# EAGLE design kanal_v1 (EAGLE 6.3)
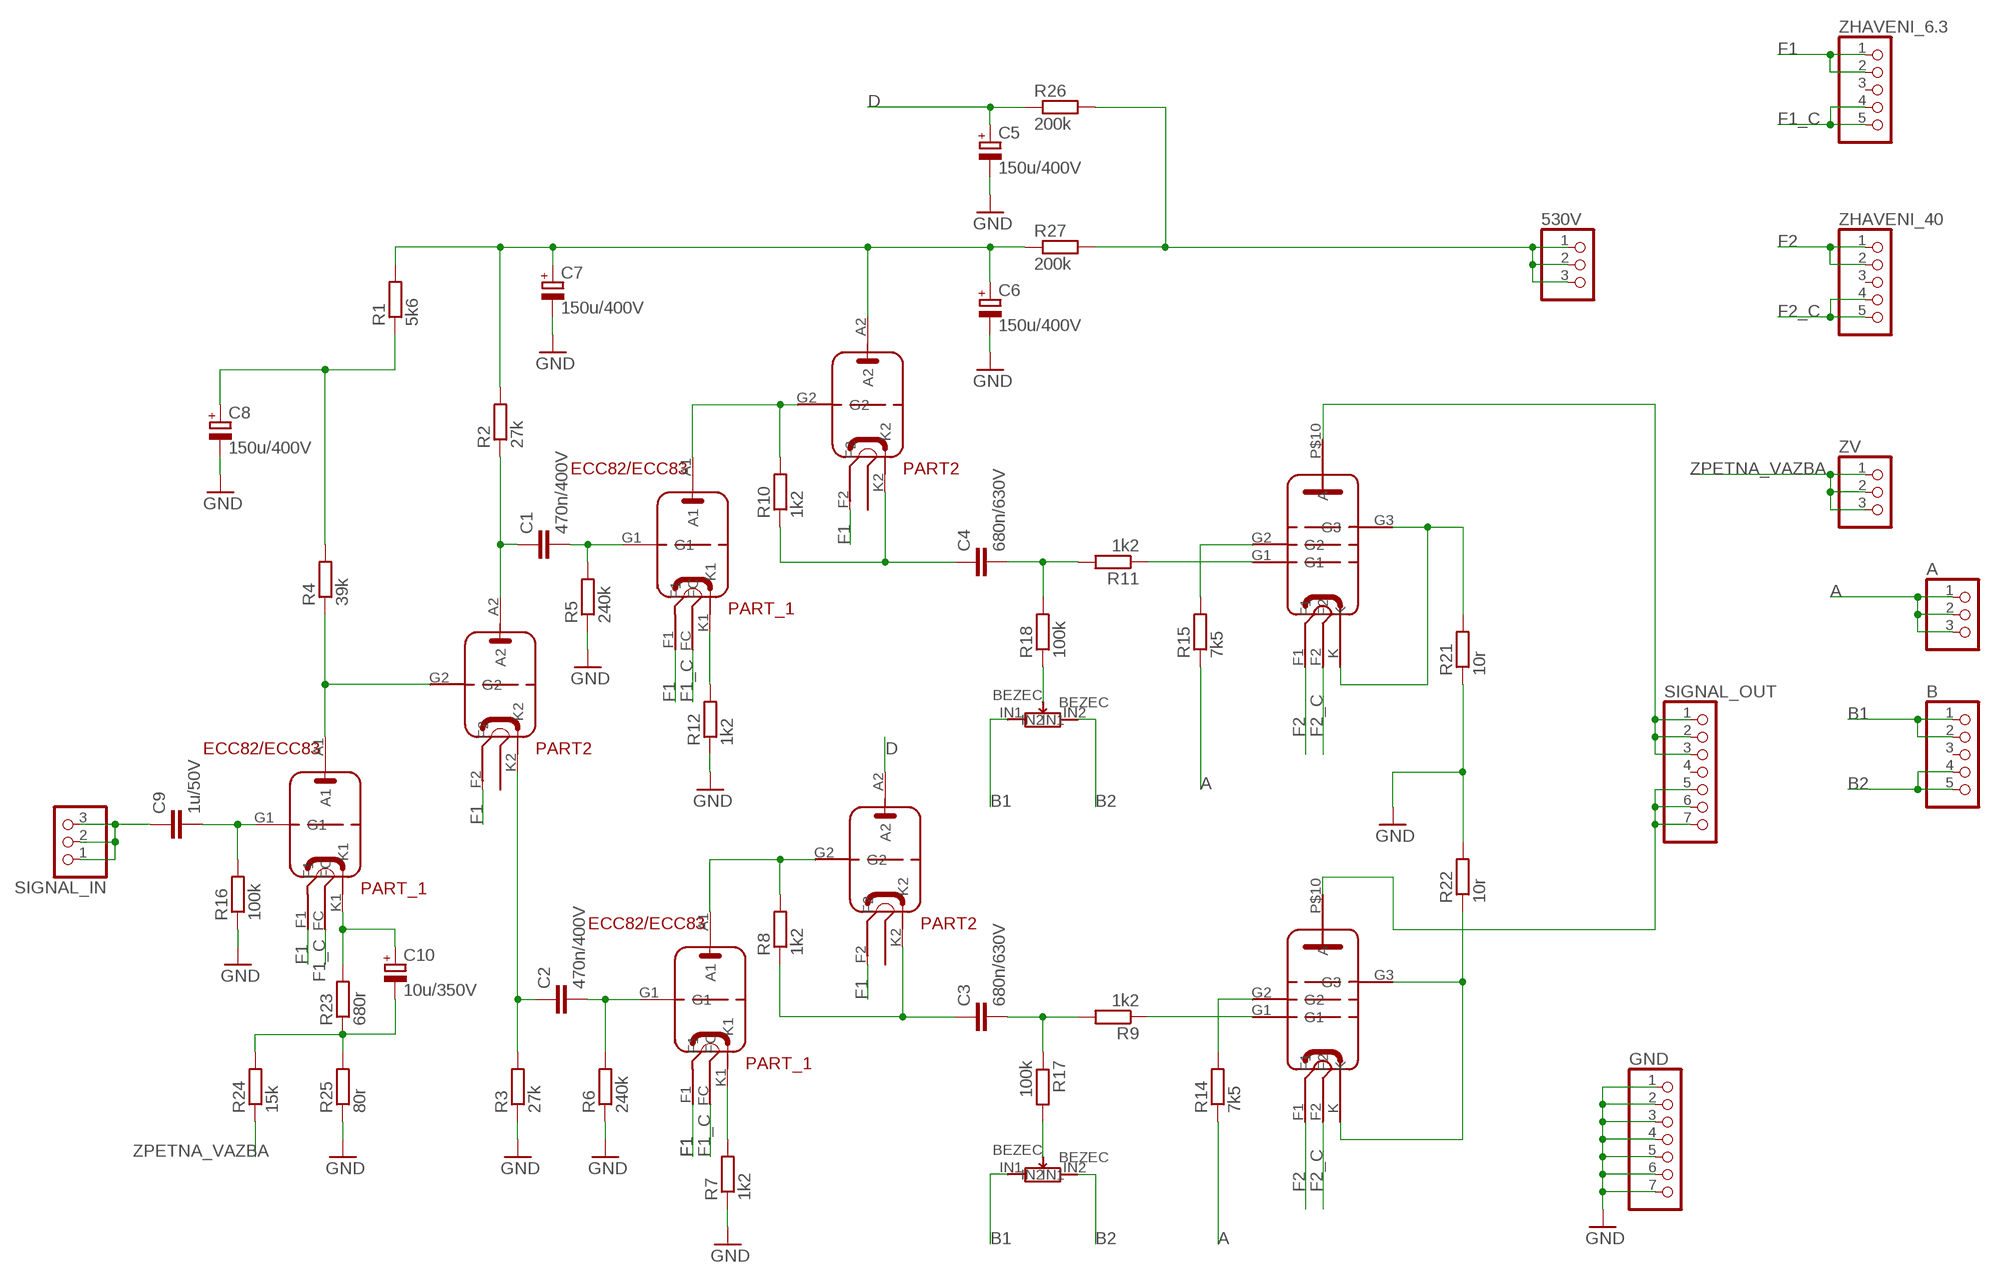
[diagram p0: schematic, sheet 1]

## Parts
530V  PINHD-1X3  [1X03]
A  PINHD-1X3  [1X03]
B  PINHD-1X5  [1X05]
C1  470n/400V  C15/7  [C15B7]
C2  470n/400V  C15/7  [C15B7]
C3  680n/630V  C27/11  [C27.5B11]
C4  680n/630V  C27/11  [C27.5B11]
C5  150u/400V  CPOL-EUE10-25  [EB25D]
C6  150u/400V  CPOL-EUE10-25  [EB25D]
C7  150u/400V  CPOL-EUE10-25  [EB25D]
C8  150u/400V  CPOL-EUE10-25  [EB25D]
C9  1u/50V  C5/3.5  [C5B3.5]
C10  10u/350V  CPOL-EUE5-10.5  [E5-10,5]
GND  PINHD-1X7  [1X07]
R1  5k6  R-EU_0309/10  [0309/10]
R2  27k  R-EU_0309/10  [0309/10]
R3  27k  R-EU_0309/10  [0309/10]
R4  39k  R-EU_0309/10  [0309/10]
R5  240k  R-EU_0309/10  [0309/10]
R6  240k  R-EU_0309/10  [0309/10]
R7  1k2  R-EU_0309/10  [0309/10]
R8  1k2  R-EU_0309/10  [0309/10]
R9  1k2  R-EU_0309/10  [0309/10]
R10  1k2  R-EU_0309/10  [0309/10]
R11  1k2  R-EU_0309/10  [0309/10]
R12  1k2  R-EU_0309/10  [0309/10]
R14  7k5  R-EU_0309/10  [0309/10]
R15  7k5  R-EU_0309/10  [0309/10]
R16  100k  R-EU_0309/10  [0309/10]
R17  100k  R-EU_0309/10  [0309/10]
R18  100k  R-EU_0309/10  [0309/10]
R21  10r  R-EU_0309/10  [0309/10]
R22  10r  R-EU_0309/10  [0309/10]
R23  680r  R-EU_0309/10  [0309/10]
R24  15k  R-EU_0309/10  [0309/10]
R25  80r  R-EU_0309/10  [0309/10]
R26  200k  R-EU_0309/10  [0309/10]
R27  200k  R-EU_0309/10  [0309/10]
SIGNAL_IN  PINHD-1X3  [1X03]
SIGNAL_OUT  PINHD-1X7  [1X07]
U$1  ECC82  [ECC82_PACKAGE]
U$2  ECC83  [ECC82_PACKAGE]
U$3  ECC83  [ECC82_PACKAGE]
U$4  PL509  [PL509_PACKAGE]
U$5  PL509  [PL509_PACKAGE]
U$6  TRIMMER  [TRIMMER_15X15_PACKAGE]
U$7  TRIMMER  [TRIMMER_15X15_PACKAGE]
ZHAVENI_6.3  PINHD-1X5  [1X05]
ZHAVENI_40  PINHD-1X5  [1X05]
ZV  PINHD-1X3  [1X03]

## Nets
A: A.1 A.2 A.3 R14.1 R15.1
B1: B.1 B.2 U$6.IN1 U$7.IN1
B2: B.4 B.5 U$6.IN2 U$7.IN2
D: C5.+ R26.1 U$3.A2
F1: U$1.F1 U$1.F2 U$2.F1 U$2.F2 U$3.F1 U$3.F2 ZHAVENI_6.3.1 ZHAVENI_6.3.2
F1_C: U$1.FC U$2.FC U$3.FC ZHAVENI_6.3.4 ZHAVENI_6.3.5
F2: U$4.F1 U$5.F1 ZHAVENI_40.1 ZHAVENI_40.2
F2_C: U$4.F2 U$5.F2 ZHAVENI_40.4 ZHAVENI_40.5
GND: C5.- C6.- C7.- C8.- GND.1 GND.2 GND.3 GND.4 GND.5 GND.6 GND.7 R3.1 R5.1 R6.1 R7.1 R12.1 R16.1 R21.1 R22.2 R25.1
N$1: C9.2 R16.2 U$1.G1
N$2: C10.+ R23.2 U$1.K1
N$3: C10.- R23.1 R24.2 R25.2
N$4: R4.1 U$1.A1 U$1.G2
N$5: C8.+ R1.1 R4.2
N$6: C1.1 R2.1 U$1.A2
N$7: C6.+ C7.+ R1.2 R2.2 R27.1 U$2.A2
N$8: C2.1 R3.2 U$1.K2
N$9: C1.2 R5.2 U$2.G1
N$10: C2.2 R6.2 U$3.G1
N$11: R17.2 U$6.BEZEC
N$12: R7.2 U$3.K1
N$13: R8.2 U$3.A1 U$3.G2
N$14: C3.1 R8.1 U$3.K2
N$15: C3.2 R9.2 R17.1
N$16: R9.1 U$5.G1
N$17: R14.2 U$5.G2
N$18: C4.1 R10.1 U$2.K2
N$19: R22.1 U$5.G3 U$5.K
N$20: R21.2 U$4.G3 U$4.K
N$21: R10.2 U$2.A1 U$2.G2
N$22: SIGNAL_OUT.5 SIGNAL_OUT.6 SIGNAL_OUT.7 U$5.P$10(A)
N$23: 530V.1 530V.2 530V.3 R26.2 R27.2
N$24: C4.2 R11.2 R18.2
N$25: R11.1 U$4.G1
N$26: R18.1 U$7.BEZEC
N$27: R12.2 U$2.K1
N$28: C9.1 SIGNAL_IN.1 SIGNAL_IN.2 SIGNAL_IN.3
N$29: R15.2 U$4.G2
N$30: SIGNAL_OUT.1 SIGNAL_OUT.2 SIGNAL_OUT.3 U$4.P$10(A)
ZPETNA_VAZBA: R24.1 ZV.1 ZV.2 ZV.3
Unconnected: B.3 SIGNAL_OUT.4 ZHAVENI_6.3.3 ZHAVENI_40.3

## Library data of the parts
530V A SIGNAL_IN ZV = pinhead:PINHD-1X3: PIN HEADER
B ZHAVENI_6.3 ZHAVENI_40 = pinhead:PINHD-1X5: PIN HEADER
C1-C4 C9 = capacitor-wima:C: CAPACITOR naming: grid - package width
C5-C8 = resistor:CPOL-EU: POLARIZED CAPACITOR, European symbol
C10 = rcl:CPOL-EU: POLARIZED CAPACITOR, European symbol
GND SIGNAL_OUT = pinhead:PINHD-1X7: PIN HEADER
R1-R12 R14-R18 R21-R27 = rcl:R-EU_: RESISTOR, European symbol
U$1 = elektronky:ECC82
U$2 U$3 = elektronky:ECC83
U$4 U$5 = elektronky:PL509
U$6 U$7 = elektronky:TRIMMER

## Board
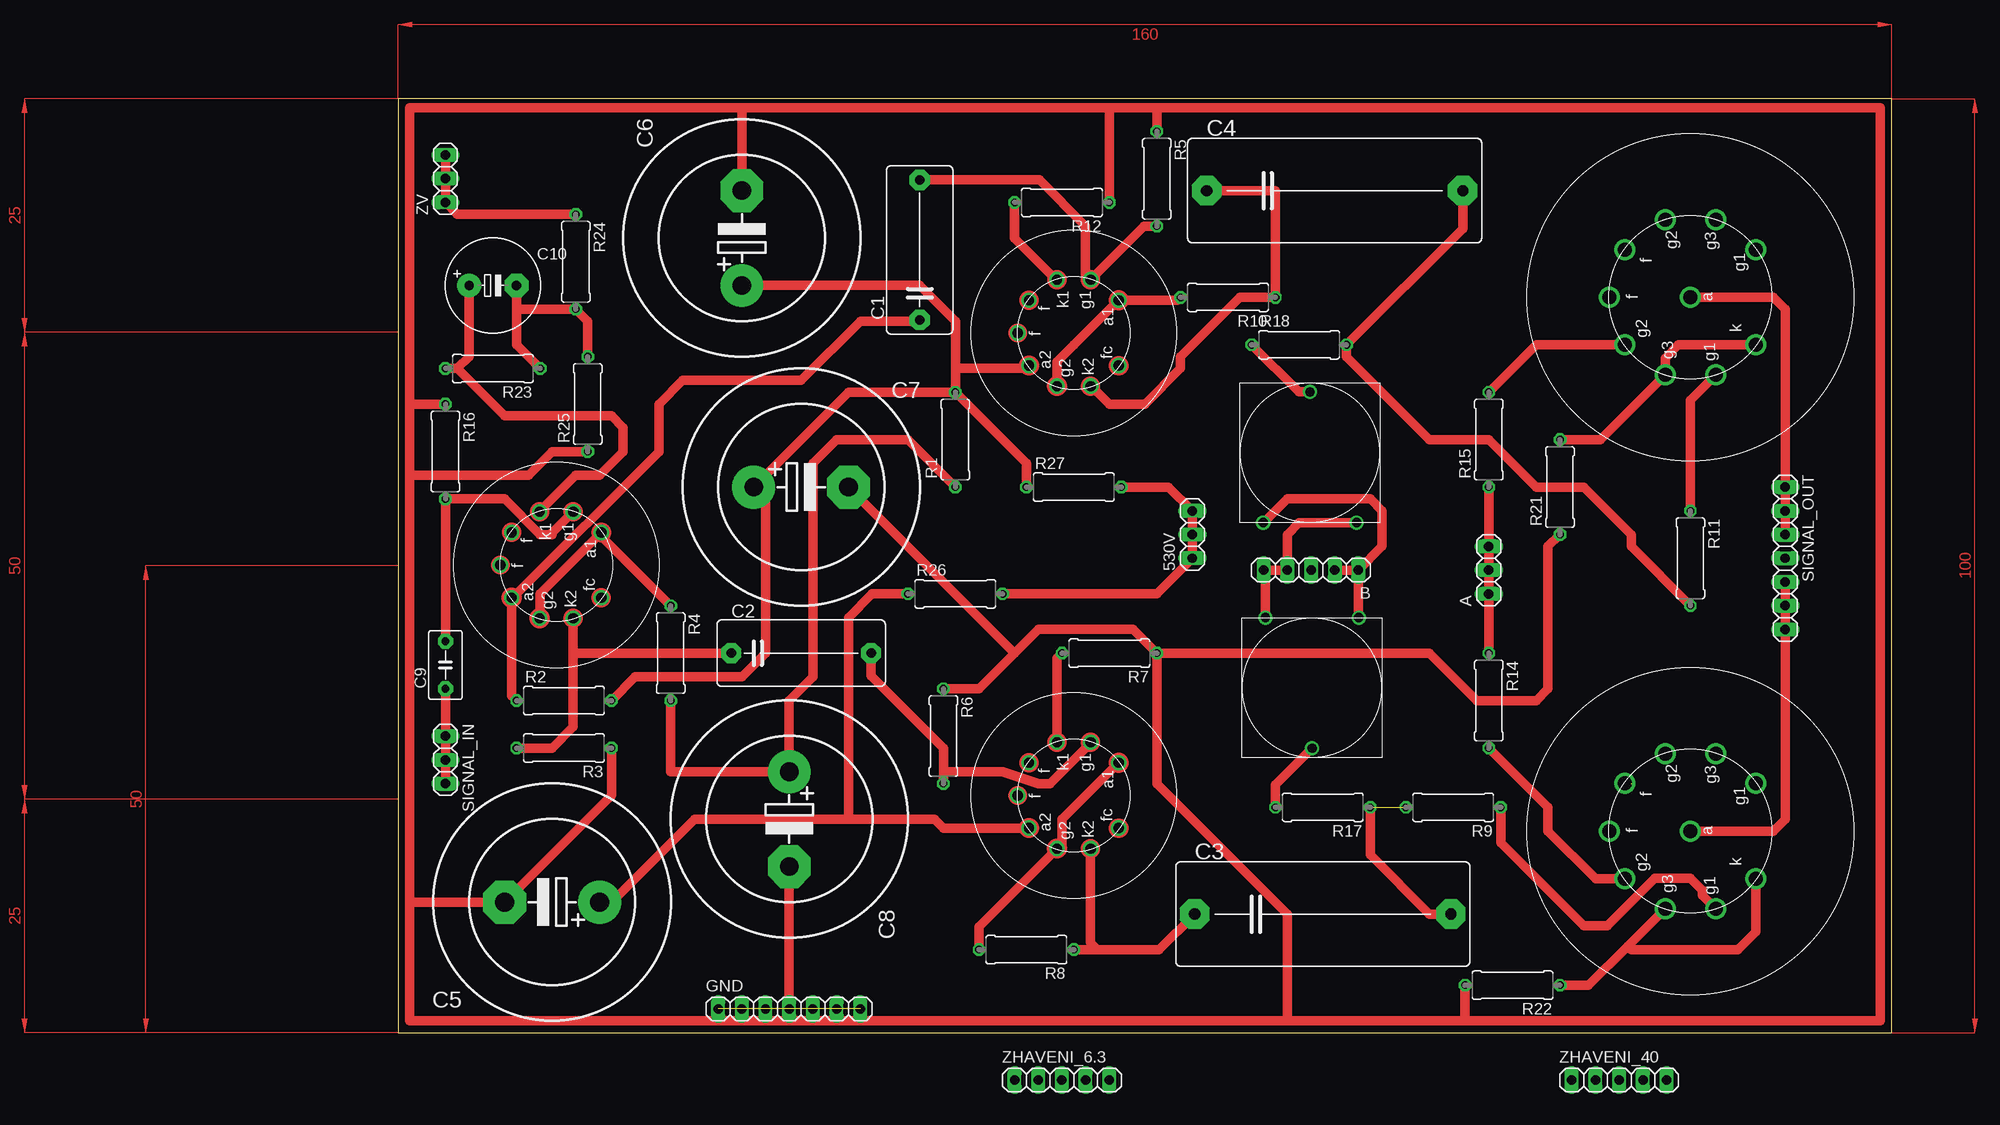
[diagram p1: board, top side]
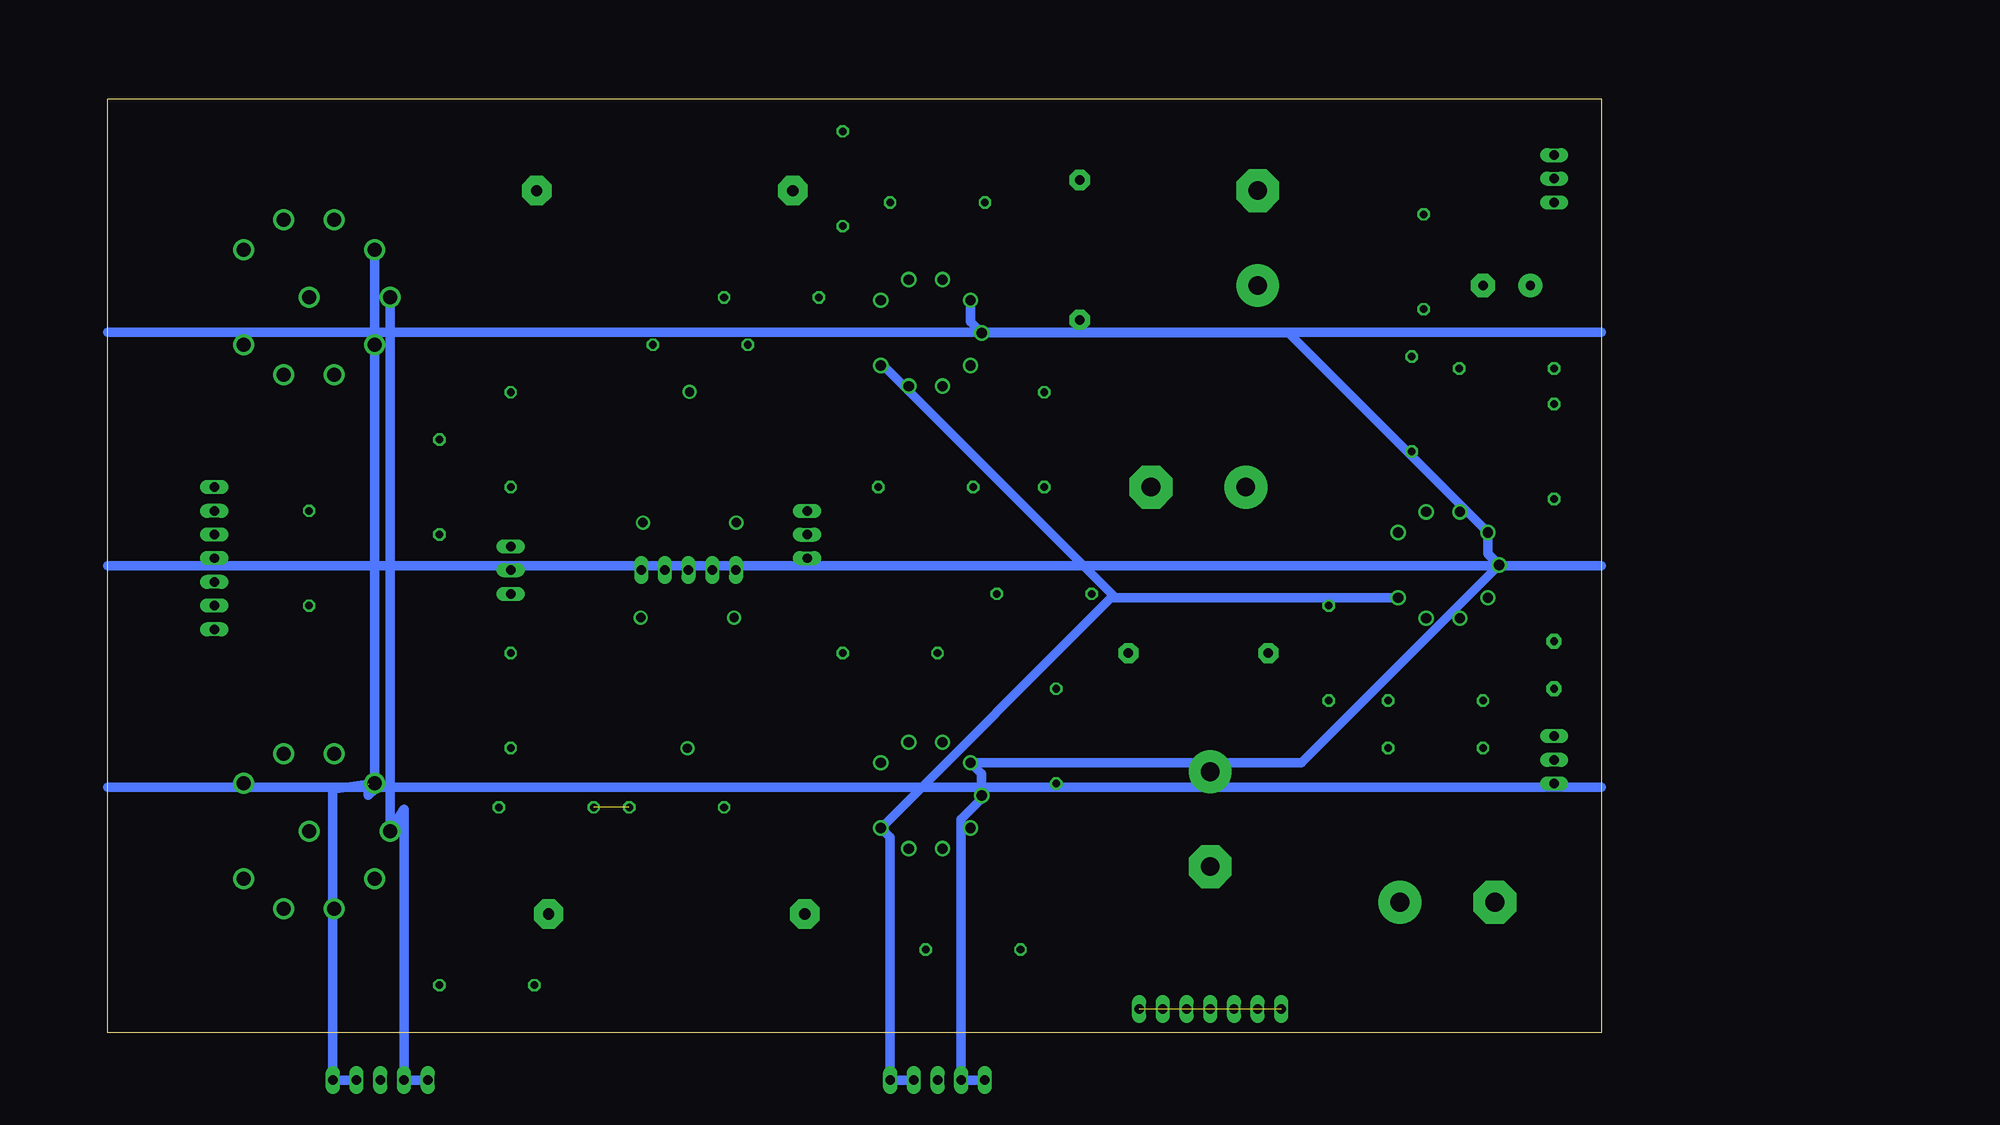
[diagram p2: board, bottom side, seen from below]

Size 160 x 100 mm. Coordinates in mm from the lower left corner, seen from the top.
Outline: 0,0 160,0 160,100 0,100 0,0
Copper layers (1*16): Top 0.035mm / dielectric 1.5mm / Bottom 0.035mm
Design rules "default": minimum track width 10mil, minimum drill 24mil, track to track 8mil, track to pad 8mil, pad to pad 8mil, via to via 8mil, smd to smd 8mil, copper to edge 40mil, drill to drill 8mil, minimum pad ring 10mil, minimum via ring 8mil, stop-mask expansion 4mil, vias tented up to drill 0mil, thermal gap 10mil

### Footprints (pad centres in the part's own frame; a part is rotated, then mirrored left to right if it is on the bottom)
1X03 = drill 1.016 long: 1 -2.54,0; 2 0,0; 3 2.54,0
1X05 = drill 1.016 long: 1 -5.08,0; 2 -2.54,0; 3 0,0; 4 2.54,0; 5 5.08,0
C15B7 = drill 1.016 pad 2.159 octagon: 1 -7.493,0; 2 7.493,0
C27.5B11 = drill 1.194 pad 3.15 octagon: 1 -13.716,0; 2 13.716,0
EB25D = drill 2.007 pad 4.597: + -5.08,0 | drill 2.007 pad 4.597 octagon: - 5.08,0
C5B3.5 = drill 0.813 pad 1.6 octagon: 1 -2.54,0; 2 2.54,0
E5-10,5 = drill 1.016 pad 2.54: + -2.54,0 | drill 1.016 pad 2.54 octagon: - 2.54,0
1X07 = drill 1.016 long: 1 -7.62,0; 2 -5.08,0; 3 -2.54,0; 4 0,0; 5 2.54,0; 6 5.08,0; 7 7.62,0
0309/10 = drill 0.813 octagon: 1 -5.08,0; 2 5.08,0
ECC82_PACKAGE = drill 1.1: A1 -3.5,4.8; A2 3.5,-4.8; F1 -3.5,-4.8; F2 0,-6; FC 3.5,4.8; G1 -5.7,1.8; G2 5.7,-1.8; K1 -5.7,-1.8; K2 5.7,1.8
PL509_PACKAGE = drill 1.5: F1 0,8.7; F2 5.1,7; G1 -8.3,-2.7; G2 -5.1,7; G3 -8.3,2.7; G_1 5.1,-7; G_2 8.3,2.7; G_3 8.3,-2.7; K -5.1,-7; P$10 0,0
TRIMMER_15X15_PACKAGE = drill 1: BEZEC 7.5,14; IN1 2.5,0; IN2 12.5,0

### Placement (x,y rotation side)
530V  85.09,53.34 90 top
A  116.84,49.53 90 top
B  97.79,49.53 180 top
C1  55.88,83.82 90 top
C2  43.18,40.64 0 top
C3  99.06,12.7 0 top
C4  100.33,90.17 0 top
C5  16.51,13.97 180 top
C6  36.83,85.09 90 top
C7  43.18,58.42 0 top
C8  41.91,22.86 270 top
C9  5.08,39.37 90 top
C10  10.16,80.01 0 top
GND  41.91,2.54 0 top
R1  59.69,63.5 90 top
R2  17.78,35.56 0 top
R3  17.78,30.48 180 top
R4  29.21,40.64 270 top
R5  81.28,91.44 270 top
R6  58.42,31.75 270 top
R7  76.2,40.64 180 top
R8  67.31,8.89 180 top
R9  113.03,24.13 180 top
R10  88.9,78.74 180 top
R11  138.43,50.8 270 top
R12  71.12,88.9 180 top
R14  116.84,35.56 270 top
R15  116.84,63.5 90 top
R16  5.08,62.23 270 top
R17  99.06,24.13 180 top
R18  96.52,73.66 0 top
R21  124.46,58.42 90 top
R22  119.38,5.08 180 top
R23  10.16,71.12 180 top
R24  19.05,82.55 270 top
R25  20.32,67.31 90 top
R26  59.69,46.99 0 top
R27  72.39,58.42 0 top
SIGNAL_IN  5.08,29.21 270 top
SIGNAL_OUT  148.59,50.8 270 top
U$1  16.97,50.07 270 top
U$2  72.39,74.93 270 top
U$3  72.39,25.4 270 top
U$4  138.43,78.74 90 top
U$5  138.43,21.59 90 top
U$6  105.41,44.45 180 top
U$7  90.17,54.61 0 top
ZHAVENI_6.3  71.12,-5.08 0 top  (outside the outline)
ZHAVENI_40  130.81,-5.08 0 top  (outside the outline)
ZV  5.08,91.44 90 top

### Tracks (layer width: path | path; a pad name or v marks a point on that pad's centre or on a via)
A
  Top 1.016: R14.1 A.1 A.2 A.3 R15.1
B1
  Top 1.016: B.1 102.87,44.49 U$6.IN1 | B.2 B.1 | U$7.IN1 92.71,54.61 95.25,57.15 104.14,57.15 105.41,55.88 105.41,52.07 B.1
B2
  Top 1.016: U$6.IN2 92.91,49.33 B.5 B.4 95.25,53.34 96.52,54.61 U$7.IN2
D
  Top 1.016: U$3.A2 58.42,21.9 57.46,22.86 48.26,22.86 | C5.+ 22.86,13.97 31.75,22.86 48.26,22.86 | R26.1 50.8,46.99 48.26,44.45 48.26,22.86
F1
  Bottom 1.016: U$2.F1 67.59,76.13 U$2.F2 33.53,74.93 U$1.F1 12.17,51.27 U$1.F2 32.14,28.9 U$3.F1 66.39,27.7 U$3.F2 66.04,25.4 68.58,22.86 ZHAVENI_6.3.2 ZHAVENI_6.3.1
F1_C
  Bottom 1.016: U$1.FC 52.07,46.57 | 52.07,46.57 52.52,46.57 U$3.FC 76.2,20.91 ZHAVENI_6.3.5 ZHAVENI_6.3.4 | U$2.FC 76.93,71.43 52.07,46.57
F2
  Bottom 1.016: ZHAVENI_40.1 ZHAVENI_40.2 128.27,23.94 U$5.F1 U$4.F1
F2_C  (1 unrouted)
  Bottom 1.016: U$5.F2 135.89,26.04 ZHAVENI_40.5 ZHAVENI_40.4 | U$4.F2 131.43,26.05 132.08,25.4 132.08,26.67
GND  (6 unrouted)
  Top 1.016: GND.1 34.29,1.27 | 34.29,1.27 1.27,1.27 1.27,13.97 | 34.29,1.27 95.25,1.27 | 95.25,1.27 114.3,1.27 | 114.3,1.27 158.75,1.27 158.75,99.06 81.28,99.06 | 81.28,99.06 76.2,99.06 | 76.2,99.06 36.83,99.06 | 36.83,99.06 1.27,99.06 1.27,67.31 | 1.27,67.31 1.27,59.69 | 1.27,59.69 1.27,13.97 | 1.27,13.97 C5.- 22.86,25.4 R3.1 | C6.- 36.83,99.06 | R16.1 1.27,67.31 | 1.27,59.69 13.97,59.69 16.51,62.23 R25.1 | R6.1 62.23,36.83 66.04,40.64 | 66.04,40.64 68.58,43.18 78.74,43.18 R7.1 | R7.1 81.28,26.67 95.25,12.7 95.25,1.27 | C8.- GND.4 | C7.- 66.04,40.64 | R12.1 76.2,99.06 | R5.1 81.28,99.06 | R22.2 114.3,1.27 | R7.1 110.49,40.64 115.57,35.56 121.92,35.56 123.19,36.83 123.19,52.07 R21.1
N$1
  Top 1.016: C9.2 R16.2 11.43,57.15 15.24,53.34 16.51,53.34 16.51,53.51 U$1.G1
N$2
  Top 1.016: U$1.K1 15.17,55.81 19.05,59.69 21.59,59.69 24.13,62.23 24.13,64.77 22.86,66.04 11.43,66.04 6.35,71.12 | 6.35,71.12 R23.2 | C10.+ 7.62,72.39 6.35,71.12
N$3
  Top 1.016: C10.- 12.7,77.47 | 12.7,77.47 12.7,73.66 R23.1 | 12.7,77.47 R24.2 20.32,76.2 R25.2
N$4
  Top 1.016: U$1.A1 21.77,53.52 | 21.77,53.52 15.24,46.99 15.24,44.44 U$1.G2 | 21.77,53.52 21.77,53.16 R4.1
N$5
  Top 1.016: R4.2 29.21,27.94 C8.+ 41.91,35.56 44.45,38.1 44.45,60.96 46.99,63.5 54.61,63.5 R1.1
N$6
  Top 1.016: R2.1 12.17,36.09 U$1.A2 12.28,46.57 27.94,62.23 27.94,67.31 30.48,69.85 43.18,69.85 49.53,76.2 55.75,76.2 C1.1
N$7
  Top 1.016: C6.+ 55.88,80.01 59.69,76.2 59.69,71.12 | 59.69,71.12 67.28,71.12 U$2.A2 | R1.2 48.26,68.58 C7.+ 39.37,57.15 39.37,40.64 36.83,38.1 25.4,38.1 R2.2 | R1.2 59.69,71.12 | R27.1 67.31,60.96 R1.2
N$8
  Top 1.016: U$1.K2 18.77,40.64 | 18.77,40.64 18.77,32.74 16.51,30.48 R3.2 | C2.1 18.77,40.64
N$9
  Top 1.016: C1.2 68.71,91.31 73.66,86.36 73.66,81.16 U$2.G1 | 74.84,81.28 U$2.G1 | R5.2 79.92,86.36 U$2.G1
N$10
  Top 1.016: C2.2 50.67,38.23 58.42,30.48 58.42,27.94 | 58.42,27.94 R6.2 | U$3.G1 74.19,31.01 69.85,26.67 68.58,26.67 64.77,27.94 58.42,27.94
N$11
  Top 1.016: R17.2 93.98,26.52 U$6.BEZEC
N$12
  Top 1.016: U$3.K1 70.59,40.11 R7.2
N$13
  Top 1.016: R8.2 62.23,11.34 U$3.G2 71.12,20.23 71.12,22.86 77.16,28.9 U$3.A1
N$14
  Top 1.016: R8.1 74.93,8.89 | 74.93,8.89 81.53,8.89 C3.1 | U$3.K2 74.19,9.63 74.93,8.89
N$15  (1 unrouted)
  Top 1.016: C3.2 110.49,12.7 104.14,19.05 R17.1
N$16
  Top 1.016: R9.1 118.11,20.32 127,11.43 129.54,11.43 134.62,16.51 138.43,16.51 139.7,15.24 139.7,14.72 U$5.G1
N$17
  Top 1.016: U$5.G2 128.29,16.49 123.19,21.59 123.19,24.13 R14.2
N$18
  Top 1.016: C4.1 93.98,90.17 R10.1 90.17,78.74 83.82,72.39 83.82,71.12 80.01,67.31 76.2,67.31 74.28,69.23 U$2.K2
N$19
  Top 1.016: R22.1 127.52,5.08 131.71,9.27 | 131.71,9.27 U$5.G3 | U$5.K 145.43,10.81 143.51,8.89 132.08,8.89 131.71,9.27
N$20
  Top 1.016: R21.2 128.79,63.5 U$4.G3 135.73,72.23 137.16,73.66 145.41,73.66 U$4.K
N$21
  Top 1.016: R10.2 83.51,78.43 U$2.A1 72.42,73.66 72.39,73.66 70.59,71.86 U$2.G2
N$22
  Top 1.016: U$5.P$10 147.32,21.59 148.59,22.86 SIGNAL_OUT.7 SIGNAL_OUT.6 SIGNAL_OUT.5
N$23
  Top 1.016: R26.2 81.28,46.99 530V.1 530V.2 530V.3 82.55,58.42 R27.2
N$24
  Top 1.016: C4.2 114.05,86.11 R18.2 101.6,72.39 110.49,63.5 116.84,63.5 121.92,58.42 127,58.42 132.08,53.34 132.08,52.07 R11.2
N$25
  Top 1.016: R11.1 138.43,67.74 U$4.G1
N$26
  Top 1.016: U$7.BEZEC 96.49,68.61 R18.1
N$27
  Top 1.016: U$2.K1 70.5,80.63 66.04,85.09 R12.2
N$28
  Top 1.016: C9.1 SIGNAL_IN.1 SIGNAL_IN.2 SIGNAL_IN.3
N$29
  Top 1.016: R15.2 121.92,73.66 131.41,73.66 U$4.G2
N$30
  Top 1.016: U$4.P$10 147.32,78.74 148.59,77.47 SIGNAL_OUT.1 SIGNAL_OUT.2 SIGNAL_OUT.3
N$33
  Bottom 1.016: 0,50 160,50
N$34
  Bottom 1.016: 0,75 160,75
N$35
  Bottom 1.016: 0,26.27 160,26.27
ZPETNA_VAZBA
  Top 1.016: R24.1 6.35,87.63 ZV.1 ZV.2 ZV.3
(copper drawn outside any net)
  shapes: Top area x6